# EAGLE design ChipPROHandheld (EAGLE 8.3.1)
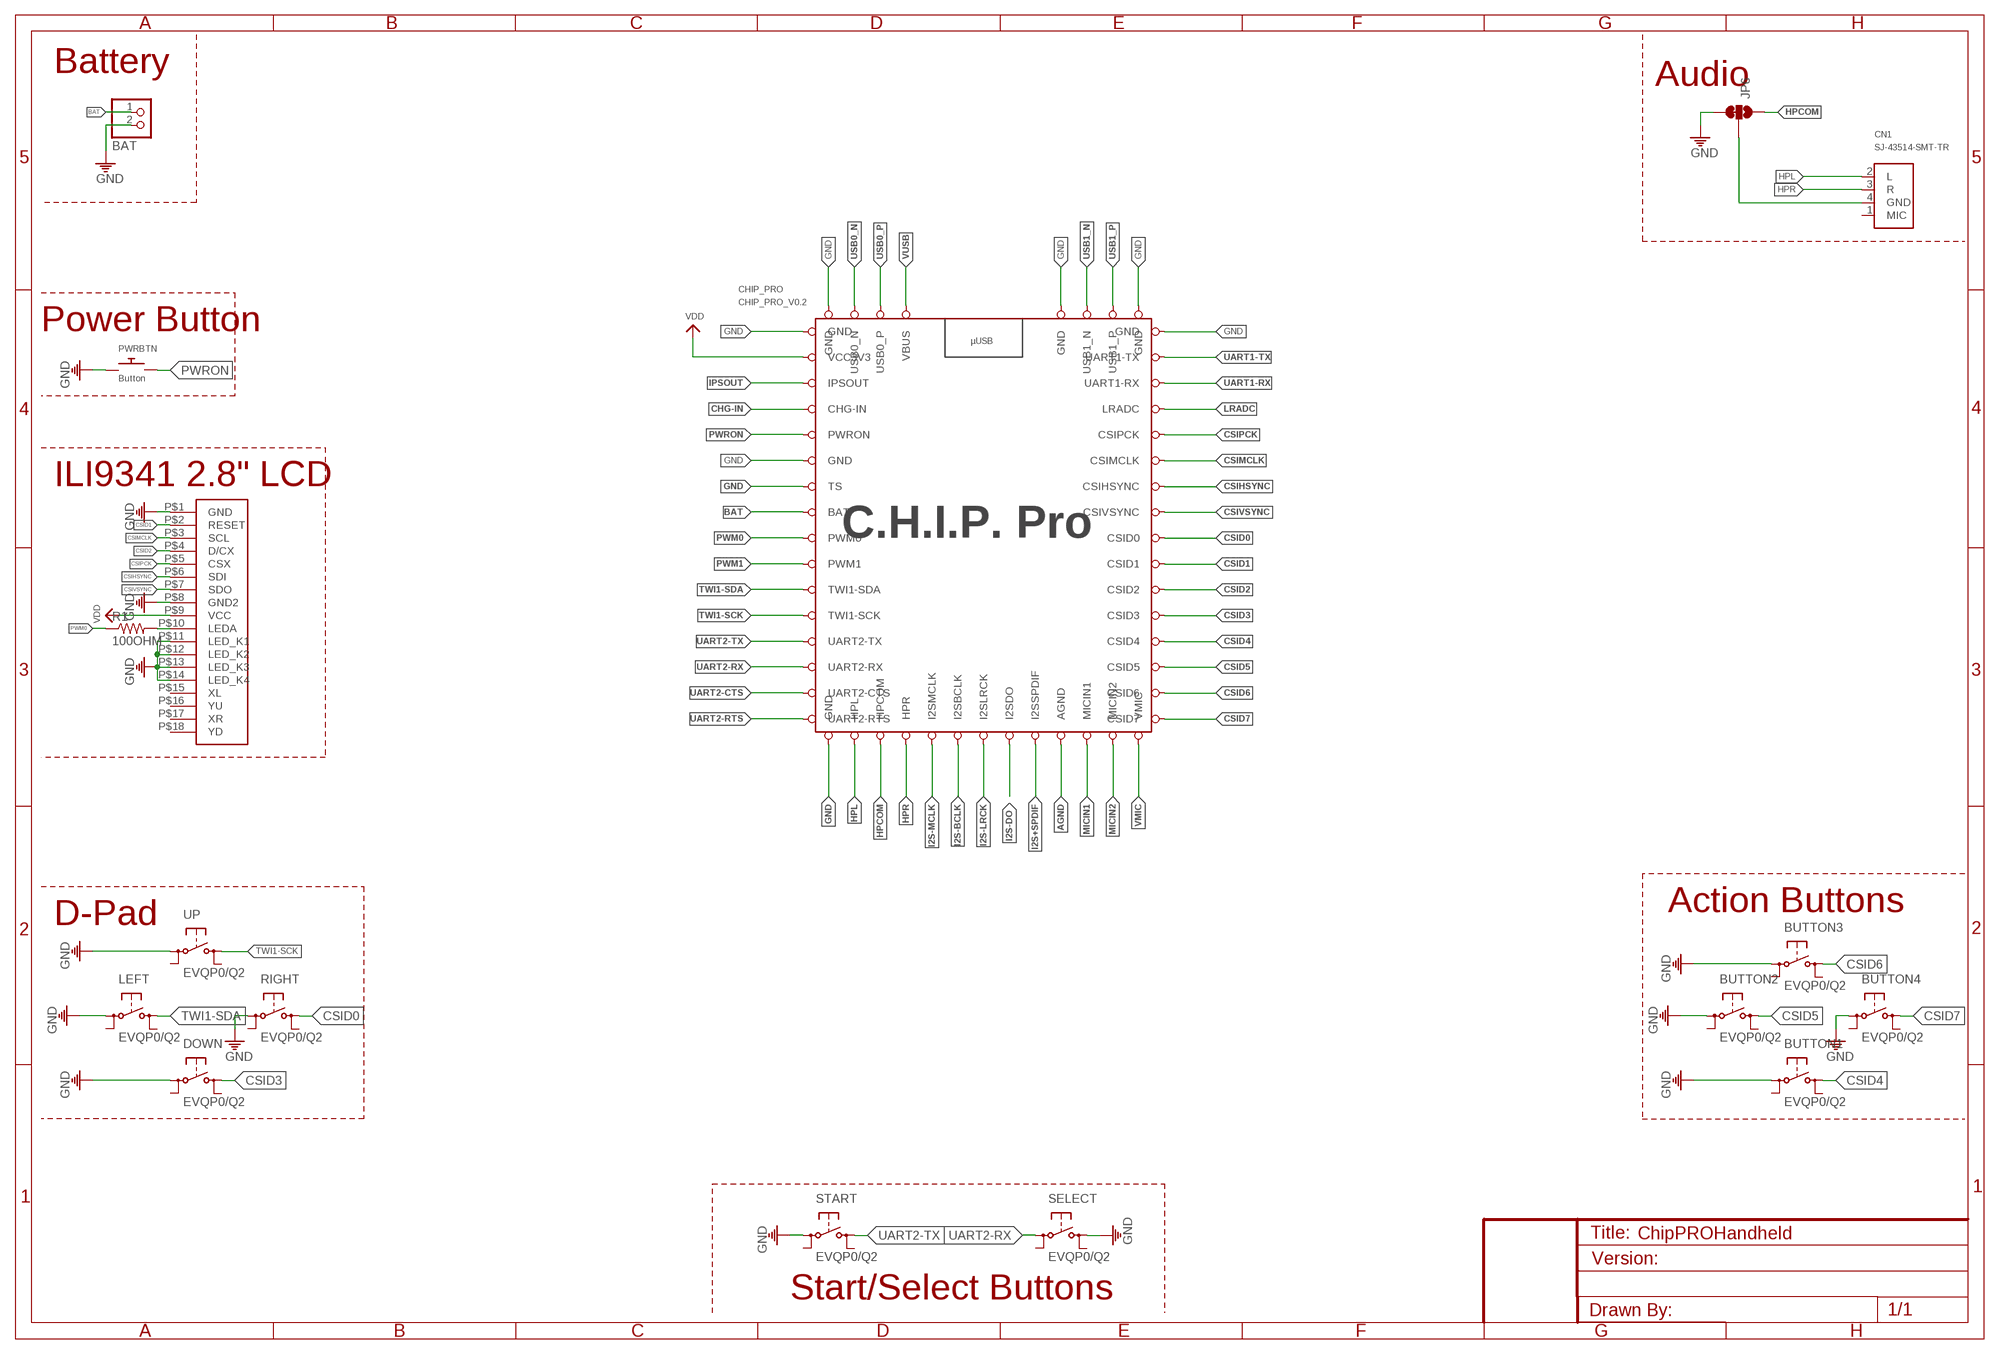
[diagram p0: schematic, sheet 1]

## Parts
BAT  JST_2PIN-SMT-RA  [JST-PH-2-SMT-RA]
BUTTON1  EVQP0/Q2  [EVQP0/Q2]
BUTTON2  EVQP0/Q2  [EVQP0/Q2]
BUTTON3  EVQP0/Q2  [EVQP0/Q2]
BUTTON4  EVQP0/Q2  [EVQP0/Q2]
CHIP_PRO  CHIP_PRO_V0.2  GR8_MODULE_V0.1  [GR8_MODULE_V0.2]
CN1  SJ-43514-SMT-TR  [SJ-43514-SMT-TR]
DOWN  EVQP0/Q2  [EVQP0/Q2]
JP6  JUMPER-PAD-3-2OF3_NC_BY_TRACE_LARGE  [PAD-JUMPER-3-2OF3_NC_BY_TRACE_YES_SILK_LARGE]
LEFT  EVQP0/Q2  [EVQP0/Q2]
PWRBTN  Button  SWITCH_PUSHBUTTONC&K_KSS  [BTN_CK_KSS]
R1  100OHM  R-US_M0805  [M0805]
RIGHT  EVQP0/Q2  [EVQP0/Q2]
SELECT  EVQP0/Q2  [EVQP0/Q2]
START  EVQP0/Q2  [EVQP0/Q2]
U$7  ILI9341-2.2  [ILI9341]
UP  EVQP0/Q2  [EVQP0/Q2]

## Nets
AGND: CHIP_PRO.AGND
BAT: BAT.1 CHIP_PRO.BAT
CHG-IN: CHIP_PRO.CHG-IN
CSID0: CHIP_PRO.CSID0 RIGHT.3(S)
CSID1: CHIP_PRO.CSID1 U$7.P$2(RESET)
CSID2: CHIP_PRO.CSID2 U$7.P$4(D/CX)
CSID3: CHIP_PRO.CSID3 DOWN.3(S)
CSID4: BUTTON1.3(S) CHIP_PRO.CSID4
CSID5: BUTTON2.3(S) CHIP_PRO.CSID5
CSID6: BUTTON3.3(S) CHIP_PRO.CSID6
CSID7: BUTTON4.3(S) CHIP_PRO.CSID7
CSIHSYNC: CHIP_PRO.CSIHSYNC U$7.P$6(SDI)
CSIMCLK: CHIP_PRO.CSIMCLK U$7.P$3(SCL)
CSIPCK: CHIP_PRO.CSIPCK U$7.P$5(CSX)
CSIVSYNC: CHIP_PRO.CSIVSYNC U$7.P$7(SDO)
GND: BAT.2 BUTTON1.1(P) BUTTON2.1(P) BUTTON3.1(P) BUTTON4.1(P) CHIP_PRO.GND@0(GND) CHIP_PRO.GND@1(GND) CHIP_PRO.GND@2(GND) CHIP_PRO.GND@3(GND) CHIP_PRO.GND@4(GND) CHIP_PRO.GND@6(GND) CHIP_PRO.GND@7(GND) CHIP_PRO.TS DOWN.1(P) JP6.3 LEFT.1(P) PWRBTN.P$1 RIGHT.1(P) SELECT.3(S) START.1(P) U$7.P$1(GND) U$7.P$8(GND2) U$7.P$11(LED_K1) U$7.P$12(LED_K2) U$7.P$13(LED_K3) U$7.P$14(LED_K4) UP.1(P)
HPCOM: CHIP_PRO.HPCOM JP6.1
HPL: CHIP_PRO.HPL CN1.2(L)
HPR: CHIP_PRO.HPR CN1.3(R)
I2S+SPDIF: CHIP_PRO.I2S+SPDIF(I2SSPDIF)
I2S-BCLK: CHIP_PRO.I2S-BCLK(I2SBCLK)
I2S-DO: CHIP_PRO.I2S-DO(I2SDO)
I2S-LRCK: CHIP_PRO.I2S-LRCK(I2SLRCK)
I2S-MCLK: CHIP_PRO.I2S-MCLK(I2SMCLK)
IPSOUT: CHIP_PRO.IPSOUT
LRADC: CHIP_PRO.LRADC
MICIN1: CHIP_PRO.MICIN1
MICIN2: CHIP_PRO.MICIN2
N$1: R1.2 U$7.P$10(LEDA)
N$2: CN1.4(GND) JP6.2
PWM0: CHIP_PRO.PWM0 R1.1
PWM1: CHIP_PRO.PWM1
PWRON: CHIP_PRO.PWRON PWRBTN.P$2
TWI1-SCK: CHIP_PRO.TWI1-SCK UP.3(S)
TWI1-SDA: CHIP_PRO.TWI1-SDA LEFT.3(S)
UART1-RX: CHIP_PRO.UART1-RX
UART1-TX: CHIP_PRO.UART1-TX
UART2-CTS: CHIP_PRO.UART2-CTS
UART2-RTS: CHIP_PRO.UART2-RTS
UART2-RX: CHIP_PRO.UART2-RX SELECT.1(P)
UART2-TX: CHIP_PRO.UART2-TX START.3(S)
USB0_N: CHIP_PRO.USB0_N
USB0_P: CHIP_PRO.USB0_P
USB1_N: CHIP_PRO.USB1_N
USB1_P: CHIP_PRO.USB1_P
VDD: CHIP_PRO.VCC3V3 U$7.P$9(VCC)
VMIC: CHIP_PRO.VMIC
VUSB: CHIP_PRO.VBUS
Unconnected: BUTTON1.2(P1) BUTTON1.4(S1) BUTTON2.2(P1) BUTTON2.4(S1) BUTTON3.2(P1) BUTTON3.4(S1) BUTTON4.2(P1) BUTTON4.4(S1) CN1.1(MIC) DOWN.2(P1) DOWN.4(S1) LEFT.2(P1) LEFT.4(S1) RIGHT.2(P1) RIGHT.4(S1) SELECT.2(P1) SELECT.4(S1) START.2(P1) START.4(S1) U$7.P$15(XL) U$7.P$16(YU) U$7.P$17(XR) U$7.P$18(YD) UP.2(P1) UP.4(S1)

## Notes on the sheet
- Battery
- Audio
- Power Button
- ILI9341 2.8" LCD
- Action Buttons
- D-Pad
- Start/Select Buttons

## Library data of the parts
BAT = NTC-CHIP:JST_2PIN: JST 2-Pin Connectors of various flavors SMT-RA (S2B-PH-SM4) 4UConnector #17311 SMT (B2B-PH-SM4) THM-RA (S2B-PH) THM (B2B-PH)
BUTTON1-BUTTON4 DOWN LEFT RIGHT SELECT START UP = switch-panasonic:EVQP0/Q2: SMD Tactile Switch
CHIP_PRO = CHIP_PRO_Dev-Kit-v0.1:GR8_MODULE_V0.1
CN1 = NTC-CHIP:SJ-43514-SMT-TR
JP6 = SparkFun-Passives:JUMPER-PAD-3-2OF3_NC_BY_TRACE
PWRBTN = adafruit:SWITCH_PUSHBUTTON: Buttons SOFTTOUCHSMD_SJ - Soft touch temporary push button (Super Junk Akihabara) Compatible with SKPMANE010 [Mouser: 688-SKPMAN] C&K_KSS = Digikey: KSS221GLFS
R1 = adafruit:R-US_: RESISTOR, American symbol
U$7 = ili9341-28.l#1:ILI9341-2.2

## Board
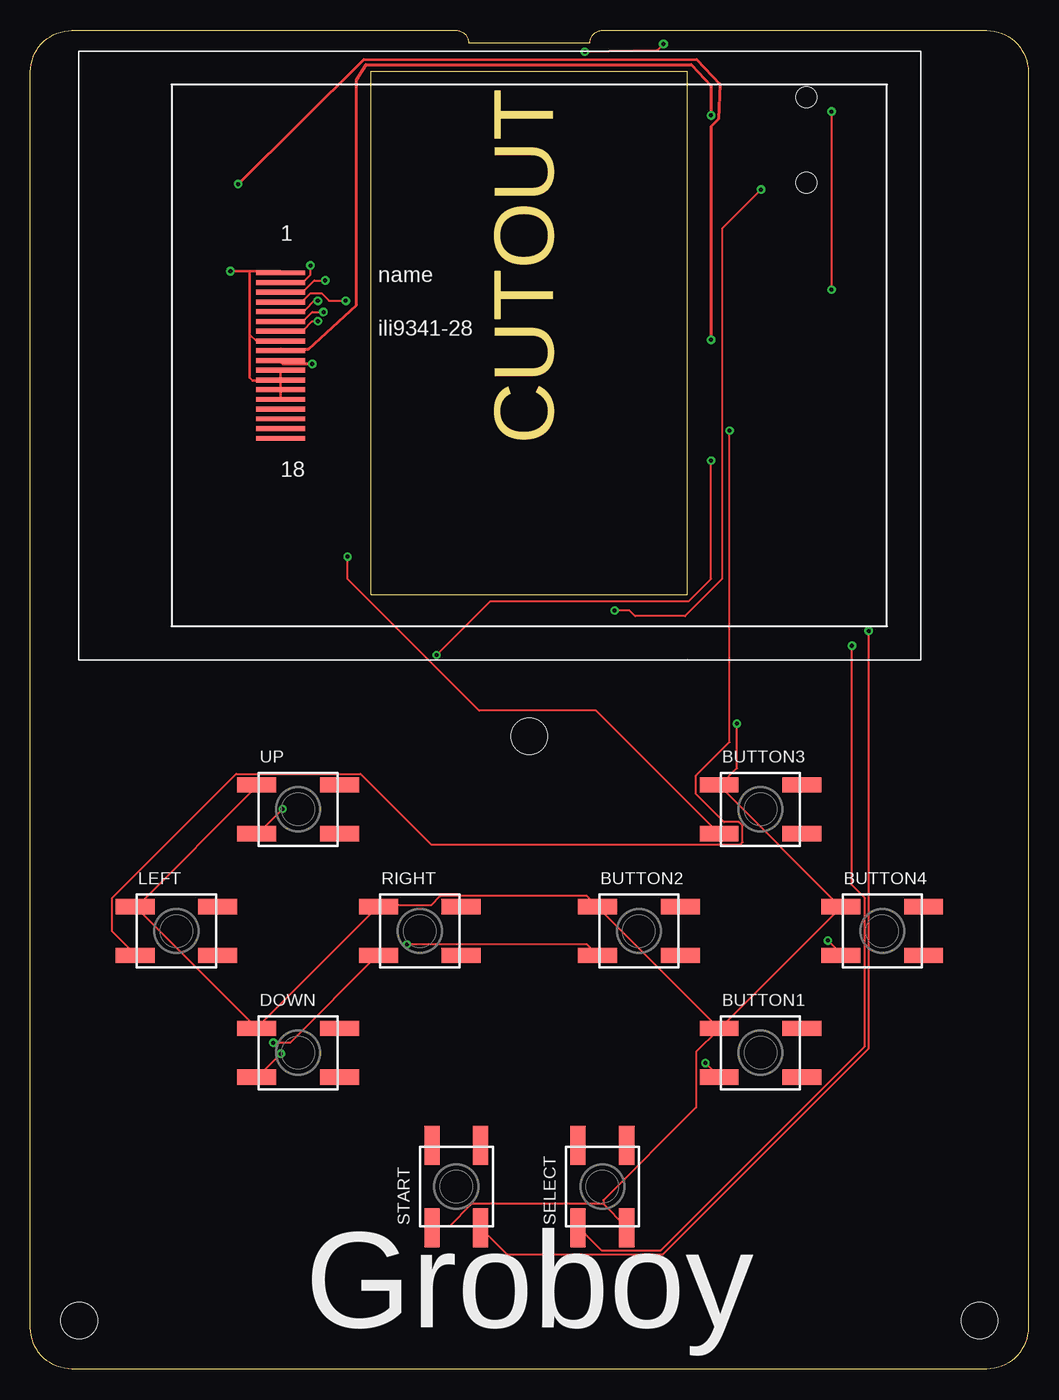
[diagram p1: board, top side]
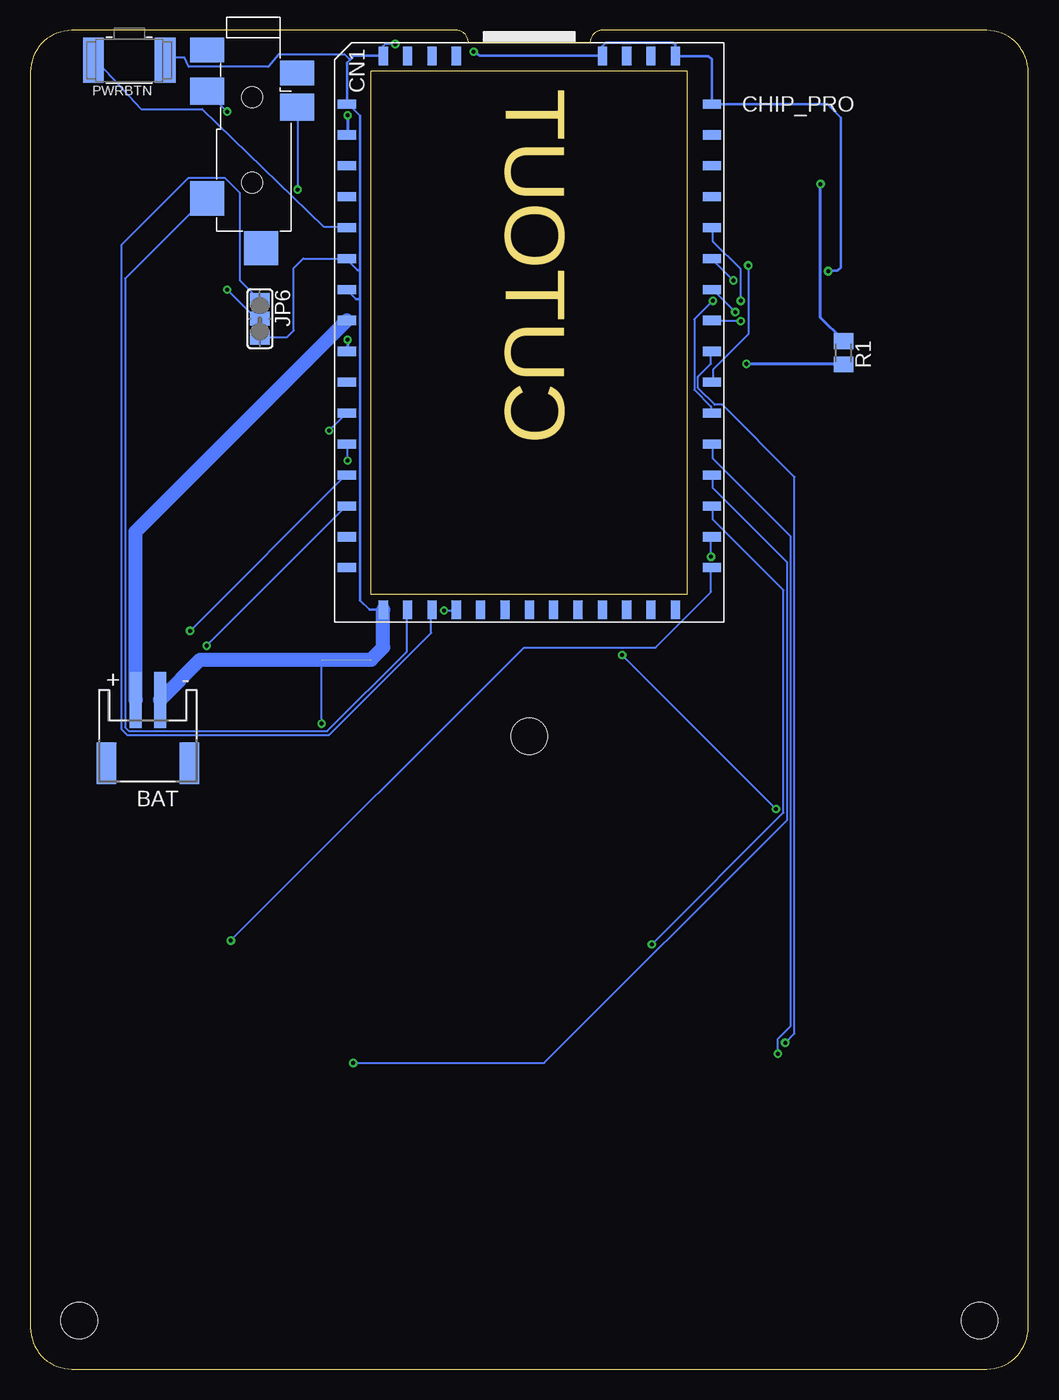
[diagram p2: board, bottom side, seen from below]

Size 82 x 110 mm. Coordinates in mm from the lower left corner, seen from the top.
Outline: 46,109 arc-90 47,110 78.59,110 arc-90 82,106.59 82,3.41 arc-90 78.59,0 3.41,0 arc-90 0,3.41 0,106.59 arc-90 3.41,110 35,110 arc-90 36,109 46,109
Copper layers (1*16): Top 0.0356mm / dielectric 1.5011mm / Bottom 0.0356mm
Design rules "oshpark-2layer": minimum track width 6mil, minimum drill 13mil, track to track 6mil, track to pad 6mil, pad to pad 6mil, via to via 6mil, smd to smd 6mil, copper to edge 15mil, drill to drill 6mil, minimum pad ring 7mil, minimum via ring 7mil, stop-mask expansion 2.5mil, vias tented up to drill 0mil, thermal gap 10mil
Holes 3 mm at 4,4 78,4 41,52

### Footprints (pad centres in the part's own frame; a part is rotated, then mirrored left to right if it is on the bottom)
JST-PH-2-SMT-RA = smd 1 x 4.6: 1 1,-3.7; 2 -1,-3.7 | smd 1.6 x 3.4: NC1 -3.4,1.5; NC2 3.4,1.5
EVQP0/Q2 = smd 3.2 x 1.25: 1 -3.4,2; 2 3.4,2; 3 -3.4,-2; 4 3.4,-2
GR8_MODULE_V0.2 = smd 0.75 x 1.5: AGND 6,-22.5; GND@1 -12,-22.5; GND@4 -12,23; GND@6 6,23; GND@7 12,23; HPCOM -8,-22.5; HPL -10,-22.5; HPR -6,-22.5; I2S+SPDIF 4,-22.5; I2S-BCLK -2,-22.5; I2S-DO 2,-22.5; I2S-LRCK 0,-22.5; I2S-MCLK -4,-22.5; MICIN1 8,-22.5; MICIN2 10,-22.5; USB0_N -10,23; USB0_P -8,23; USB1_N 8,23; USB1_P 10,23; VBUS -6,23; VMIC 12,-22.5 | smd 1.5 x 0.75: BAT -15,1.27; CHG-IN -15,11.43; CSID0 15,-1.27; CSID1 15,-3.81; CSID2 15,-6.35; CSID3 15,-8.89; CSID4 15,-11.43; CSID5 15,-13.97; CSID6 15,-16.51; CSID7 15,-19.05; CSIHSYNC 15,3.81; CSIMCLK 15,6.35; CSIPCK 15,8.89; CSIVSYNC 15,1.27; GND@0 15,19.05; GND@2 -15,6.35; GND@3 -15,19.05; IPSOUT -15,13.97; LRADC 15,11.43; PWM0 -15,-1.27; PWM1 -15,-3.81; PWRON -15,8.89; TS -15,3.81; TWI1-SCK -15,-8.89; TWI1-SDA -15,-6.35; UART1-RX 15,13.97; UART1-TX 15,16.51; UART2-CTS -15,-16.51; UART2-RTS -15,-19.05; UART2-RX -15,-13.97; UART2-TX -15,-11.43; VCC3V3 -15,16.51
SJ-43514-SMT-TR = smd 2 x 2.8: 1 -3.9,-3.7; 6 -2,3.7 | smd 2.8 x 2.8: 2 8.3,-3.7; 5 12.4,0.75 | smd 2.2 x 2.8: 3 0.8,3.7; 4 -0.5,-3.7 | hole 1.7: 0,0; 7,0
PAD-JUMPER-3-2OF3_NC_BY_TRACE_YES_SILK_LARGE = smd 1.168 x 1.6: 1 -1.524,0; 2 0,0; 3 1.524,0
BTN_CK_KSS = smd 1.7 x 3.7: P$1 -2.95,0; P$2 2.95,0
M0805 = smd 1.3 x 1.6: 1 -0.95,0; 2 0.95,0
ILI9341 = smd 4 x 0.4: P$1 -18,6.8; P$2 -18,6; P$3 -18,5.2; P$4 -18,4.4; P$5 -18,3.6; P$6 -18,2.8; P$7 -18,2; P$8 -18,1.2; P$9 -18,0.4; P$10 -18,-0.4; P$11 -18,-1.2; P$12 -18,-2; P$13 -18,-2.8; P$14 -18,-3.6; P$15 -18,-4.4; P$16 -18,-5.2; P$17 -18,-6; P$18 -18,-6.8

### Placement (x,y rotation side)
BAT  72.35,51.29 180 bottom
BUTTON1  60,26 0 top
BUTTON2  50,36 0 top
BUTTON3  60,46 0 top
BUTTON4  70,36 0 top
CHIP_PRO  41,84.9 0 bottom
CN1  63.78,104.5 270 bottom
DOWN  22,26 0 top
JP6  63.14,86.31 270 bottom
LEFT  12,36 0 top
PWRBTN  73.88,107.55 180 bottom
R1  15.18,83.51 270 bottom
RIGHT  32,36 0 top
SELECT  47,15 90 top
START  35,15 90 top
U$7  38.56,83.28 0 top
UP  22,46 0 top

### Tracks (layer width: path | path; a pad name or v marks a point on that pad's centre or on a via)
BAT
  Bottom 1.143: BAT.1 73.36,68.81 CHIP_PRO.BAT
CSID0  (via drill 0.33)
  Top 0.152: v19.96,26.82 21.34,26.82 28.5,33.98 RIGHT.3
  Bottom 0.152: v19.96,26.82 19.2,27.58 19.2,73.3 25.15,79.25 25.76,79.25 27.13,80.62 27.13,81.53 26.06,82.6 26.06,83.52 CHIP_PRO.CSID0
CSID1  (via drill 0.33)
  Top 0.152: v23.01,90.68 23.01,89.92 22.4,89.31 20.57,89.31 U$7.P$2
  Bottom 0.152: v23.01,90.68 23.01,85.04 25.91,82.14 25.91,81.23 CHIP_PRO.CSID1
CSID2  (via drill 0.33)
  Top 0.152: v25.91,87.78 24.54,87.78 23.93,88.39 23.01,88.39 22.4,87.78 20.57,87.78 U$7.P$4
  Bottom 0.152: v25.91,87.78 27.43,86.26 27.43,80.47 26.06,79.1 26.06,78.64 CHIP_PRO.CSID2
CSID3  (via drill 0.33)
  Top 0.152: v20.57,25.91 18.75,24.08 DOWN.3
  Bottom 0.152: v20.57,25.91 20.57,27.13 19.51,28.19 19.51,68.43 25.91,74.83 25.91,75.89 CHIP_PRO.CSID3
CSID4  (via drill 0.33)
  Top 0.152: v55.47,25.15 56.54,24.08 BUTTON1.3
  Bottom 0.152: v55.47,25.15 39.78,25.15 19.81,45.11 19.81,66.29 25.91,72.39 25.91,73.46 CHIP_PRO.CSID4
CSID5  (via drill 0.33)
  Top 0.152: v30.94,34.9 45.72,34.9 46.48,34.14 BUTTON2.3
  Bottom 0.152: v30.94,34.9 20.12,45.72 20.12,64.01 25.91,69.8 25.91,70.87 CHIP_PRO.CSID5
CSID6  (via drill 0.33)
  Top 0.152: v26.06,66.75 26.06,64.92 36.88,54.1 46.48,54.1 56.54,44.04 BUTTON3.3
  Bottom 0.152: v26.06,66.75 26.06,68.28 CHIP_PRO.CSID6
CSID7  (via drill 0.33)
  Top 0.152: v65.53,35.2 66.6,34.14 BUTTON4.3
  Bottom 0.152: v65.53,35.2 41.45,59.28 30.63,59.28 26.06,63.86 26.06,65.84 CHIP_PRO.CSID7
CSIHSYNC  (via drill 0.33)
  Top 0.152: v24.08,86.87 23.16,86.87 22.4,86.11 20.57,86.11 U$7.P$6
  Bottom 0.152: v24.08,86.87 25.91,88.7 CHIP_PRO.CSIHSYNC
CSIMCLK  (via drill 0.33)
  Top 0.152: v24.23,89.46 23.32,89.46 22.4,88.54 20.57,88.54 U$7.P$3
  Bottom 0.152: v24.23,89.46 25.91,91.14 CHIP_PRO.CSIMCLK
CSIPCK  (via drill 0.33)
  Top 0.152: v23.62,87.78 23.32,87.78 22.55,87.02 20.57,87.02 U$7.P$5
  Bottom 0.152: v23.62,87.78 23.62,90.37 25.91,92.66 25.91,93.73 CHIP_PRO.CSIPCK
CSIVSYNC  (via drill 0.33)
  Top 0.152: v23.62,86.11 23.16,86.11 22.4,85.34 20.57,85.34 U$7.P$7
  Bottom 0.152: v23.62,86.11 25.91,86.11 CHIP_PRO.CSIVSYNC
GND  (via drill 0.33, 0.33 pad 0.55, 0.35)  (1 unrouted)
  Top 0.152: 8.69,37.95 18.59,28.04 | 18.59,28.04 28.5,37.95 RIGHT.1 28.65,38.1 32.92,38.1 33.68,38.86 45.72,38.86 46.48,38.1 BUTTON2.1 46.63,37.95 56.54,28.04 BUTTON1.1 | 18.59,28.04 DOWN.1 | 8.69,37.95 18.59,47.85 UP.1 | 8.69,37.95 LEFT.1 | 47.09,13.56 36.27,13.56 34.44,11.73 33.07,11.73 START.1 | 47.09,13.56 48.92,11.73 SELECT.3 | 66.6,37.95 56.69,28.04 BUTTON1.1 | 66.6,37.95 56.69,47.85 BUTTON3.1 56.69,48.01 58.06,49.38 v58.06,53.03 | 66.6,37.95 BUTTON4.1 | 47.09,13.56 47.09,13.87 54.71,21.49 54.71,26.06 56.54,27.89 BUTTON1.1 | 20.54,81.23 20.56,81.25
  Top 0.203: v16.43,90.22 18.03,90.22 | 18.03,90.22 20.56,90.22 U$7.P$1 | U$7.P$8 20.56,84.45 20.54,84.43 18.62,84.43 18.03,85.01 | U$7.P$14 U$7.P$13 20.56,81.25 U$7.P$12 U$7.P$11 | v45.57,108.25 51.51,108.38 v52.02,108.89 | 18.03,90.22 18.03,85.01 | 18.03,85.01 18.03,81.46 18.26,81.23 20.54,81.23
  Bottom 0.152: PWRBTN.P$1 70.87,107.75 69.34,107.75 68.99,107.01 62.43,107.01 61.57,108.05 56.19,108.05 55.74,107.6 | v58.06,53.03 58.06,58.27 | 62.99,84.78 62.89,84.68 | 56,91.19 56.06,91.25 59.58,91.25 60.35,90.48 60.35,85.34 60.91,84.78 62.99,84.78 | JP6.3 62.99,84.78
  Bottom 0.203: CHIP_PRO.GND@0 16.52,103.95 15.42,102.84 15.42,90.5 15.67,90.25 16.41,90.25 v16.43,90.22 | CHIP_PRO.GND@0 25.93,103.95 | CHIP_PRO.GND@7 29,107.85 28.95,107.9 26.26,107.9 26,107.64 CHIP_PRO.GND@0 | 28.98,107.9 CHIP_PRO.GND@7 | 56,104.11 CHIP_PRO.GND@3 | CHIP_PRO.GND@2 56,91.19 55.11,90.3 54.89,90.3 | CHIP_PRO.GND@1 54.12,62.4 54.89,63.17 54.89,87.94 | 35.04,107.9 CHIP_PRO.GND@6 | 35.04,107.9 45.06,107.9 v45.57,108.25 | 54.89,87.94 54.89,90.3 | 54.89,90.3 54.89,103 56,104.11 | 54.89,87.94 55.23,87.94 CHIP_PRO.TS | CHIP_PRO.GND@7 29,108.81 29.18,108.99 34.7,108.99 34.98,108.71 34.98,107.96 35.04,107.9 | v52.02,108.89 52.81,108.89 53.01,108.69 CHIP_PRO.GND@4 55.45,107.9 55.74,107.6 55.98,107.37 55.98,104.13 56,104.11
  Bottom 1.143: CHIP_PRO.GND@1 53,59.29 54,58.29 68.04,58.29 BAT.2
HPCOM
  Bottom 0.152: JP6.1 64.77,89.46 64.77,96.62 65.99,97.84 69.04,97.84 74.52,92.35 74.52,52.58 74.07,52.12 57.45,52.12 49.07,60.5 49.07,62.33 CHIP_PRO.HPCOM
HPL
  Bottom 0.152: CHIP_PRO.HPL 51.05,62.33 51.05,58.98 57.61,52.43 73.91,52.43 74.22,52.73 74.22,89.61 67.51,96.32 CN1.2
HPR  (via drill 0.33)
  Top 0.152: v48.01,62.33 49.23,62.33 49.68,61.87 53.8,61.87 56.84,64.92 56.84,93.73 v60.05,96.93
  Bottom 0.152: v48.01,62.33 47.09,62.33 CHIP_PRO.HPR | v60.05,96.93 60.05,103.94 CN1.3
N$1  (via drill 0.33)
  Top 0.254: v23.16,82.6 20.73,82.6 20.57,82.75 U$7.P$10
  Bottom 0.152: 15.24,82.6 R1.2
  Bottom 0.254: v23.16,82.6 15.24,82.6
N$2  (via drill 0.33)
  Top 0.152: v65.84,103.33 v65.84,88.7
  Bottom 0.152: v65.84,88.7 63.55,86.41 63.25,86.41 JP6.2 | v65.84,103.33 67.36,104.85 CN1.4
PWM0  (via drill 0.33)
  Top 0.254: v55.93,84.58 55.93,102.11 56.54,102.72 56.67,105.59 54.74,107.62 27.38,107.59 v17.07,97.38
  Bottom 0.152: 55.93,83.67 CHIP_PRO.PWM0 | 15.24,84.58 R1.1
  Bottom 0.254: v55.93,84.58 55.93,83.67 | v17.07,97.38 17.07,86.41 15.24,84.58
PWRON
  Bottom 0.152: CHIP_PRO.PWRON 56.08,93.88 57.91,93.88 67.87,103.53 72.9,103.53 76.81,107.75 PWRBTN.P$2
TWI1-SCK  (via drill 0.33)
  Top 0.152: v55.93,74.65 55.93,64.92 54.1,63.09 37.8,63.09 v33.38,58.67 | v20.73,46.02 18.75,44.04 UP.3
  Bottom 0.152: v55.93,74.65 55.93,75.89 CHIP_PRO.TWI1-SCK | v20.73,46.02 v33.38,58.67
TWI1-SDA  (via drill 0.33)
  Top 0.152: v57.45,77.11 57.45,51.51 54.71,48.77 54.71,47.24 57,44.96 58.22,44.96 58.52,44.65 58.52,43.28 58.37,43.13 32.92,43.13 27.13,48.92 16.92,48.92 6.71,38.71 6.71,35.97 8.53,34.14 LEFT.3
  Bottom 0.152: v57.45,77.11 56.08,78.49 CHIP_PRO.TWI1-SDA
UART2-RX  (via drill 0.33)
  Top 0.152: v67.51,59.44 67.51,39.78 68.58,38.71 68.58,26.52 51.82,9.75 46.94,9.75 45.11,11.58 SELECT.1
  Bottom 0.152: v67.51,59.44 56.08,70.87 CHIP_PRO.UART2-RX
UART2-TX  (via drill 0.33)
  Top 0.152: v68.89,60.66 68.89,26.36 51.97,9.45 39.17,9.45 37.03,11.58 START.3
  Bottom 0.152: v68.89,60.66 56.08,73.46 CHIP_PRO.UART2-TX
VDD  (via drill 0.33)
  Top 0.152: 20.57,83.82 U$7.P$9
  Top 0.254: v55.93,103.02 55.93,105.46 54.3,107.19 27.58,107.19 26.82,105.97 26.8,87.43 22.86,83.82 20.57,83.82
  Bottom 0.152: 55.93,101.5 CHIP_PRO.VCC3V3
  Bottom 0.254: v55.93,103.02 55.93,101.5

### Text on the board
Dimension: CUTOUT
tPlace: Groboy